# EasyEDA schematic SCH_BMS Super Capacitor_2022-08-26.json
TITLE: Supercapacitor; REV: 1.0; Date: 2020-06-28; Sheet: 1/1; Drawn By: Danisimo; Company: Your Company
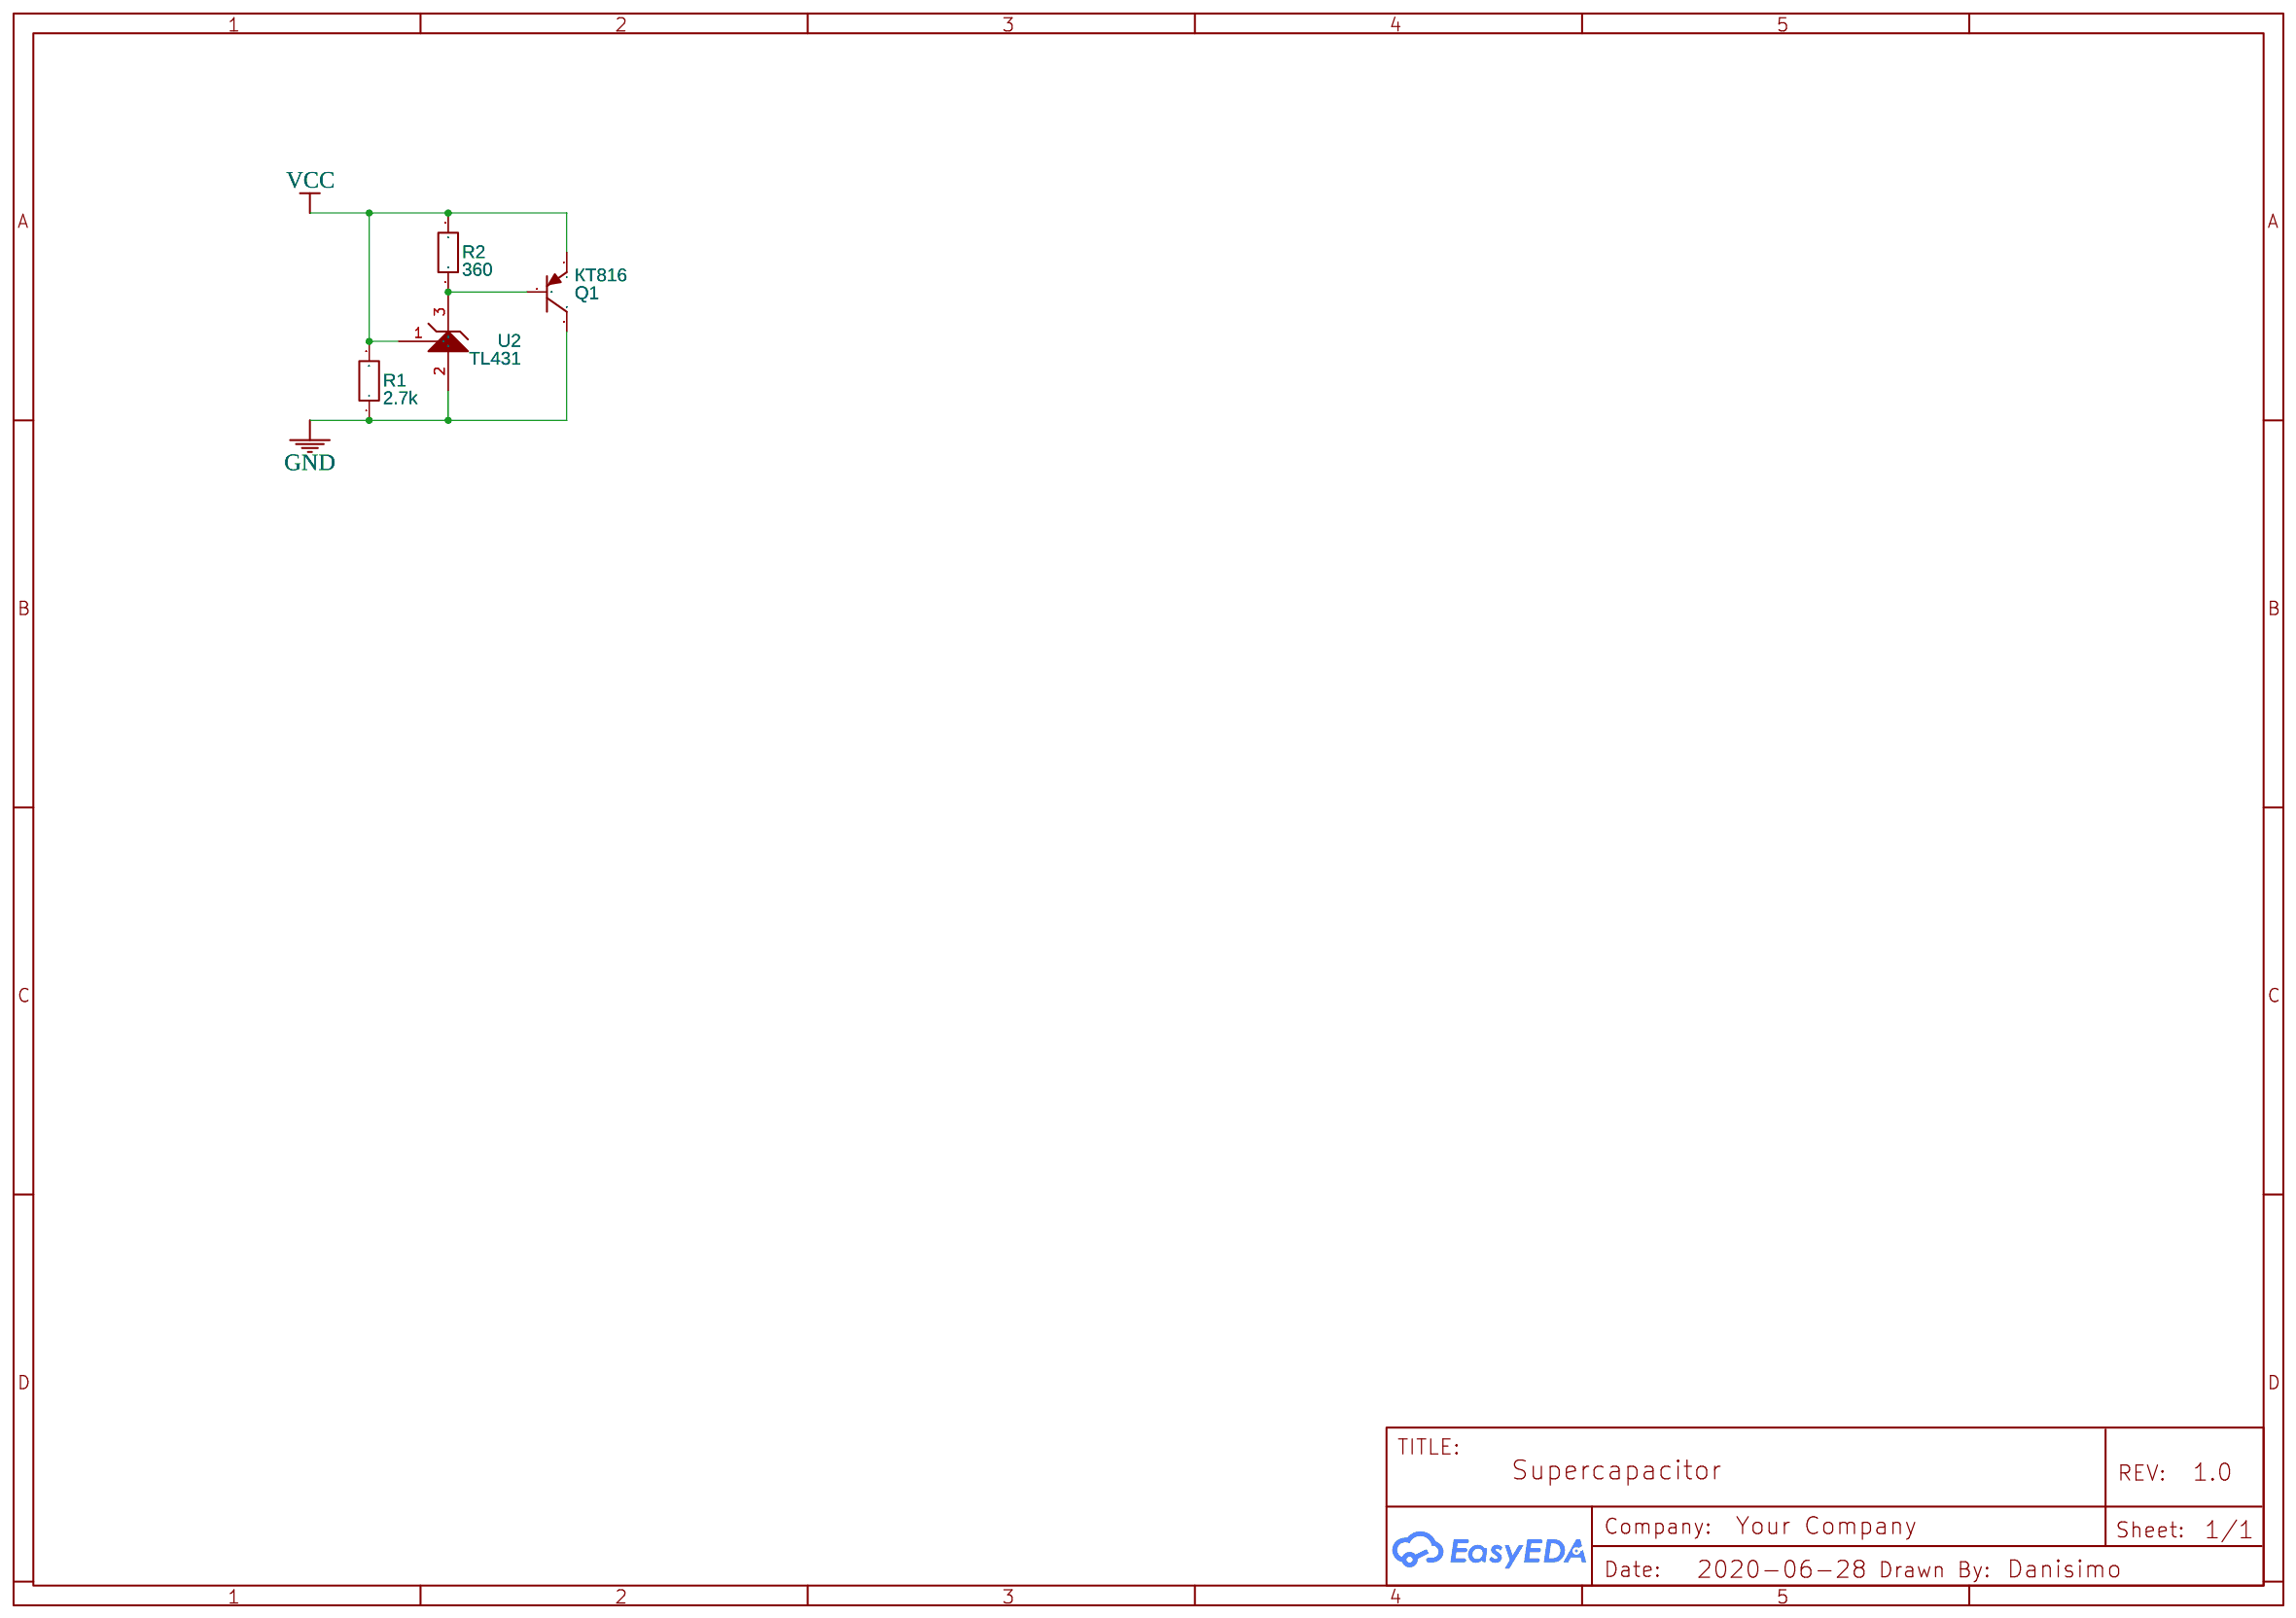
[diagram p0: schematic sheet]

## Parts
Q1  КТ816  [ТО-126 (КТ-27)]
R1  2.7k  [RES-TH_BD2.3-L6.5-P6.9-D0.5]
R2  360  [RES-TH_BD2.3-L6.5-P6.9-D0.5]
U2  TL431  [TO-92(TO-92-3)]

## Library data of the parts
Q1 = КТ816: Contributor: Дмитрий Смирнов
R1 R2 = R_0201_EU: Contributor: LCEDA_Lib
U2 = TL431: Supplier: LCSC; Manufacturer: TI; Manufacturer Part: TL431AILP; Contributor: magilishik; Supplier Part: C72108

## Nets
GND: Q1.3(C) R1.1 U2.2(ANODE)
VCC: Q1.1(E) R1.2 R2.2 U2.1(REF)
Net-(Q1-2): Q1.2(B) R2.1 U2.3(CATHODE)
